# Altium schematic sheet Switch.SchDoc
size A4; SheetNumber: 1; SheetTotal: 4
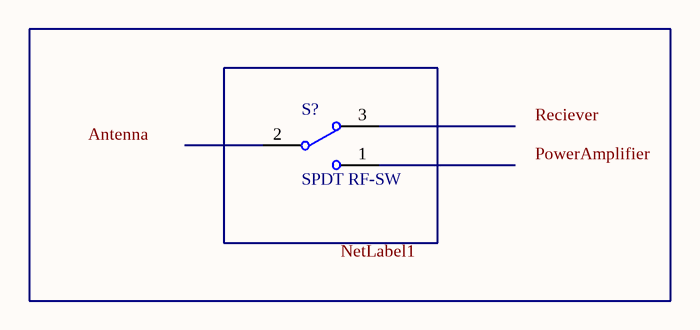
[diagram p0: Switch.SchDoc]

## Parts
S?  SPDT RF-SW  [TL36WW15050]

## Nets

Not connected (* = marked no-connect by the designer): S? 1 2 3

## Notes on the sheet
- Labels drawn without touching a wire or pin: Antenna, NetLabel1, PowerAmplifier, Reciever

## Library data of the parts
S? = SW-SPDT: SPDT Subminiature Toggle Switch, Right Angle Mounting, Vertical Actuation; Published: 24-Mar-1999; LatestRevisionDate: 17-Dec-2003; LatestRevisionNote: Schematic revised, PCB Footprint replaced.; DatasheetVersion: 05-Dec-2000; PackageReference: TL36WW15050; Publisher: Altium Limited; PackageDescription: Switch; 4 Leads; ComponentLink1Description: Manufacturer Link; ComponentLink1URL: http://www.apem.com